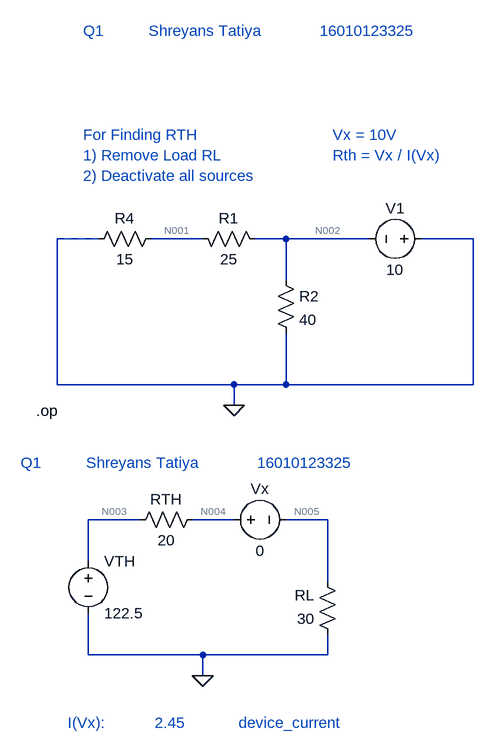
[diagram p0: schematic Draft1.asc]
Draft1.asc, the LTspice schematic file:
Version 4
SHEET 1 880 680
WIRE -544 -608 -608 -608
WIRE -384 -608 -464 -608
WIRE -256 -608 -304 -608
WIRE -128 -608 -256 -608
WIRE 32 -608 -48 -608
WIRE -256 -544 -256 -608
WIRE -608 -384 -608 -608
WIRE -336 -384 -608 -384
WIRE -256 -384 -256 -464
WIRE -256 -384 -336 -384
WIRE 32 -384 32 -608
WIRE 32 -384 -256 -384
WIRE -336 -352 -336 -384
WIRE -480 -176 -560 -176
WIRE -336 -176 -400 -176
WIRE -192 -176 -256 -176
WIRE -560 -112 -560 -176
WIRE -192 -80 -192 -176
WIRE -560 32 -560 -32
WIRE -384 32 -560 32
WIRE -192 32 -192 0
WIRE -192 32 -384 32
WIRE -384 64 -384 32
FLAG -336 -352 0
FLAG -384 64 0
SYMBOL res -400 -624 M90
WINDOW 0 0 56 VBottom 2
WINDOW 3 32 56 VTop 2
SYMATTR InstName R1
SYMATTR Value 25
SYMBOL res -272 -560 R0
SYMATTR InstName R2
SYMATTR Value 40
SYMBOL res -448 -624 R90
WINDOW 0 0 56 VBottom 2
WINDOW 3 32 56 VTop 2
SYMATTR InstName R4
SYMATTR Value 15
SYMBOL voltage -32 -608 R90
WINDOW 0 -32 56 VBottom 2
WINDOW 3 32 56 VTop 2
SYMATTR InstName V1
SYMATTR Value 10
SYMBOL voltage -560 -128 R0
SYMATTR InstName VTH
SYMATTR Value 122.5
SYMBOL res -176 16 R180
WINDOW 0 36 76 Left 2
WINDOW 3 36 40 Left 2
SYMATTR InstName RL
SYMATTR Value 30
SYMBOL res -384 -192 R90
WINDOW 0 0 56 VBottom 2
WINDOW 3 32 56 VTop 2
SYMATTR InstName RTH
SYMATTR Value 20
SYMBOL voltage -352 -176 R270
WINDOW 0 32 56 VTop 2
WINDOW 3 -32 56 VBottom 2
SYMATTR InstName Vx
SYMATTR Value 0
TEXT -640 -344 Left 2 !.op
TEXT -568 -928 Left 2 ;Q1          Shreyans Tatiya             16010123325
TEXT -568 -768 Left 2 ;For Finding RTH\n1) Remove Load RL\n2) Deactivate all sources
TEXT -664 -264 Left 2 ;Q1          Shreyans Tatiya             16010123325
TEXT -184 -768 Left 2 ;Vx = 10V\nRth = Vx / I(Vx)
TEXT -592 136 Left 2 ;I(Vx):           2.45            device_current
LINE Normal -544 -608 -608 -608 2

The netlist it stands for:
* Draft1.asc
R1 N001 N002 25
R2 N002 0 40
R4 N001 0 15
V1 0 N002 10
VTH N003 0 122.5
RL 0 N005 30
RTH N004 N003 20
Vx N004 N005 0
.op
* Q1          Shreyans Tatiya             16010123325
* For Finding RTH
* 1) Remove Load RL
* 2) Deactivate all sources
* Q1          Shreyans Tatiya             16010123325
* Vx = 10V
* Rth = Vx / I(Vx)
* I(Vx):           2.45            device_current
.backanno
.end

* Results of the author's LTspice run, read from the files saved beside the schematic
* Operating Point:
*   V(n001) = -3.75 V
*   V(n002) = -10 V
*   V(n003) = 122.5 V
*   V(n005) = 73.5 V
*   V(n004) = 73.5 V
*   I(R1) = 250 mA
*   I(R2) = -250 mA
*   I(R4) = -250 mA
*   I(Rl) = -2.45 A
*   I(Rth) = -2.45 A
*   I(V1) = -500 mA
*   I(Vth) = -2.45 A
*   I(Vx) = 2.45 A